# Altium schematic sheet Sheet_X_ring.SchDoc
size A4
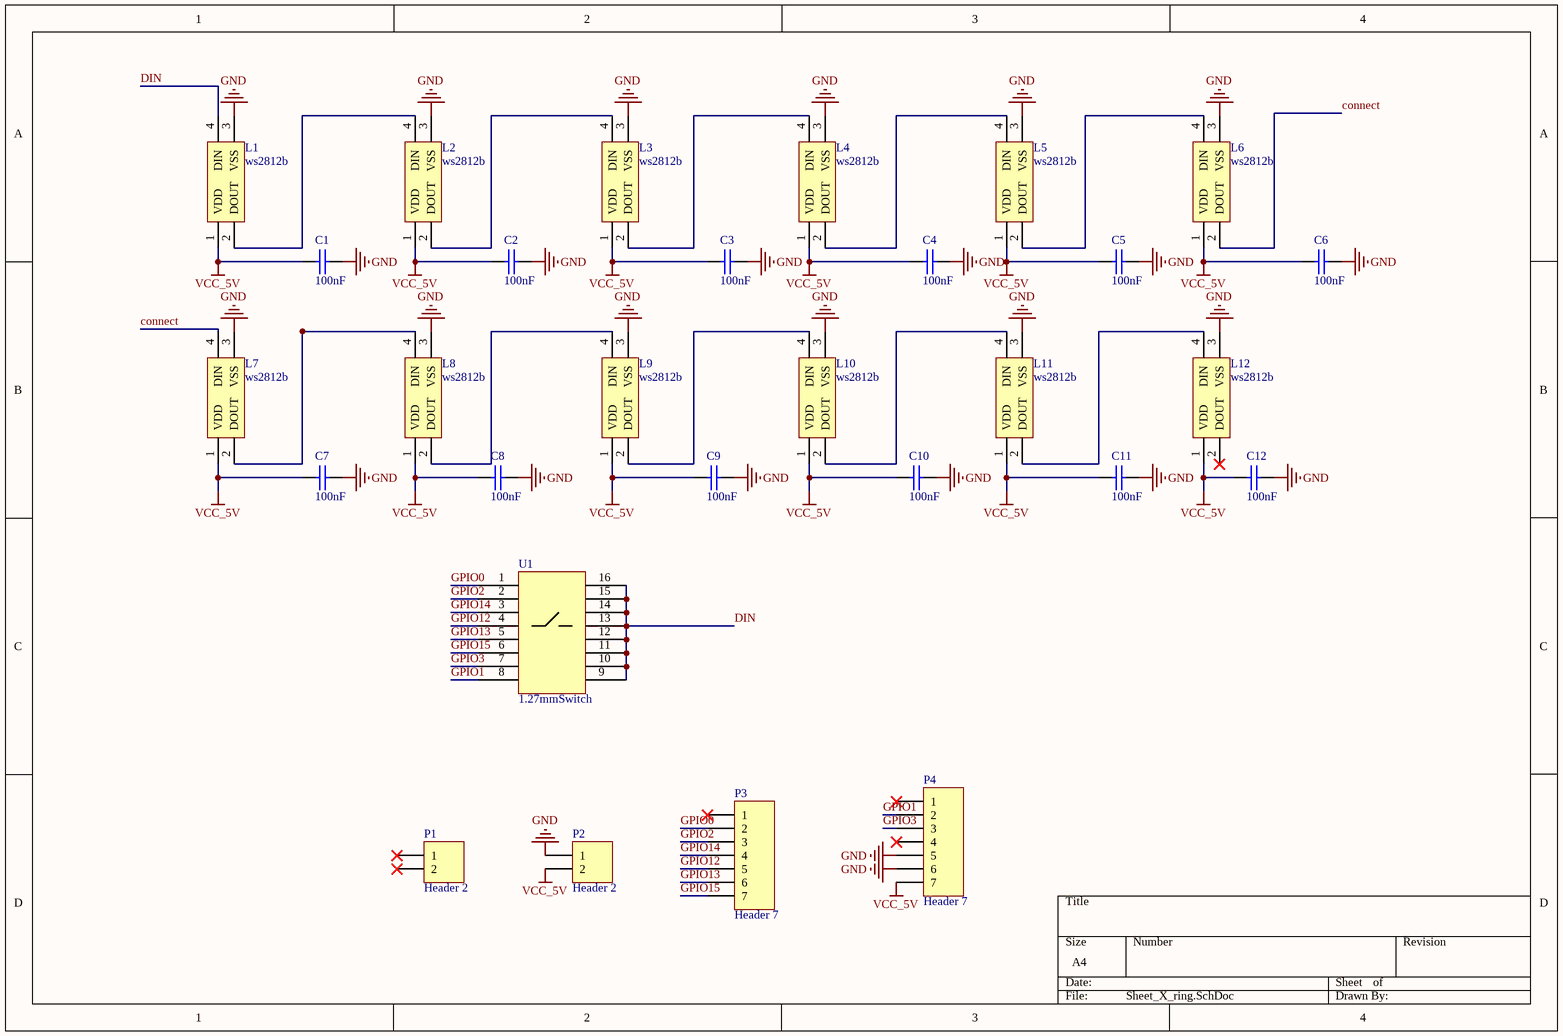
[diagram p0: Sheet_X_ring.SchDoc]

## Parts
C1  100nF  [C0603]
C2  100nF  [C0603]
C3  100nF  [C0603]
C4  100nF  [C0603]
C5  100nF  [C0603]
C6  100nF  [C0603]
C7  100nF  [C0603]
C8  100nF  [C0603]
C9  100nF  [C0603]
C10  100nF  [C0603]
C11  100nF  [C0603]
C12  100nF  [C0603]
L1  ws2812b  [ws2812b]
L2  ws2812b  [ws2812b]
L3  ws2812b  [ws2812b]
L4  ws2812b  [ws2812b]
L5  ws2812b  [ws2812b]
L6  ws2812b  [ws2812b]
L7  ws2812b  [ws2812b]
L8  ws2812b  [ws2812b]
L9  ws2812b  [ws2812b]
L10  ws2812b  [ws2812b]
L11  ws2812b  [ws2812b]
L12  ws2812b  [ws2812b]
P1  Header 2  [HDR1X2]
P2  Header 2  [HDR1X2]
P3  Header 7  [HDR1X7]
P4  Header 7  [HDR1X7]
U1  1.27mmSwitch  [NumberSwitch]

## Nets
GND: C1.2 C2.2 C3.2 C4.2 C5.2 C6.2 C7.2 C8.2 C9.2 C10.2 C11.2 C12.2 L1.3(VSS) L2.3(VSS) L3.3(VSS) L4.3(VSS) L5.3(VSS) L6.3(VSS) L7.3(VSS) L8.3(VSS) L9.3(VSS) L10.3(VSS) L11.3(VSS) L12.3(VSS) P2.1 P4.5 P4.6
VCC_5V: C1.1 C2.1 C3.1 C4.1 C5.1 C6.1 C7.1 C8.1 C9.1 C10.1 C11.1 C12.1 L1.1(VDD) L2.1(VDD) L3.1(VDD) L4.1(VDD) L5.1(VDD) L6.1(VDD) L7.1(VDD) L8.1(VDD) L9.1(VDD) L10.1(VDD) L11.1(VDD) L12.1(VDD) P2.2 P4.7
connect: L6.2(DOUT) L7.4(DIN)
DIN: L1.4(DIN) U1.9 U1.10 U1.11 U1.12 U1.13 U1.14 U1.15 U1.16
GPIO0: P3.2 U1.1
GPIO1: P4.2 U1.8
GPIO2: P3.3 U1.2
GPIO3: P4.3 U1.7
GPIO12: P3.5 U1.4
GPIO13: P3.6 U1.5
GPIO14: P3.4 U1.3
GPIO15: P3.7 U1.6
NetL1_2: L1.2(DOUT) L2.4(DIN)
NetL2_2: L2.2(DOUT) L3.4(DIN)
NetL3_2: L3.2(DOUT) L4.4(DIN)
NetL4_2: L4.2(DOUT) L5.4(DIN)
NetL5_2: L5.2(DOUT) L6.4(DIN)
NetL7_2: L7.2(DOUT) L8.4(DIN)
NetL8_2: L8.2(DOUT) L9.4(DIN)
NetL9_2: L9.2(DOUT) L10.4(DIN)
NetL10_2: L10.2(DOUT) L11.4(DIN)
NetL11_2: L11.2(DOUT) L12.4(DIN)

Not connected (* = marked no-connect by the designer): L12 2(DOUT)*; P1 1* 2*; P3 1*; P4 1* 4*

## Library data of the parts
C1-C12 = C0603: 贴片电容
L1-L12 = ws2812b: RGB灯珠
P1 P2 = Header 2: Header, 2-Pin; LatestRevisionDate: 17-Jul-2002; LatestRevisionNote: Re-released for DXP Platform.; Publisher: Altium Limited
P3 P4 = Header 7: Header, 7-Pin; LatestRevisionDate: 17-Jul-2002; LatestRevisionNote: Re-released for DXP Platform.; Publisher: Altium Limited
U1 = NumberSwitch: 拨码开关